# Altium schematic sheet Amplifier.SchDoc
size A4; SheetNumber: 2; SheetTotal: 2
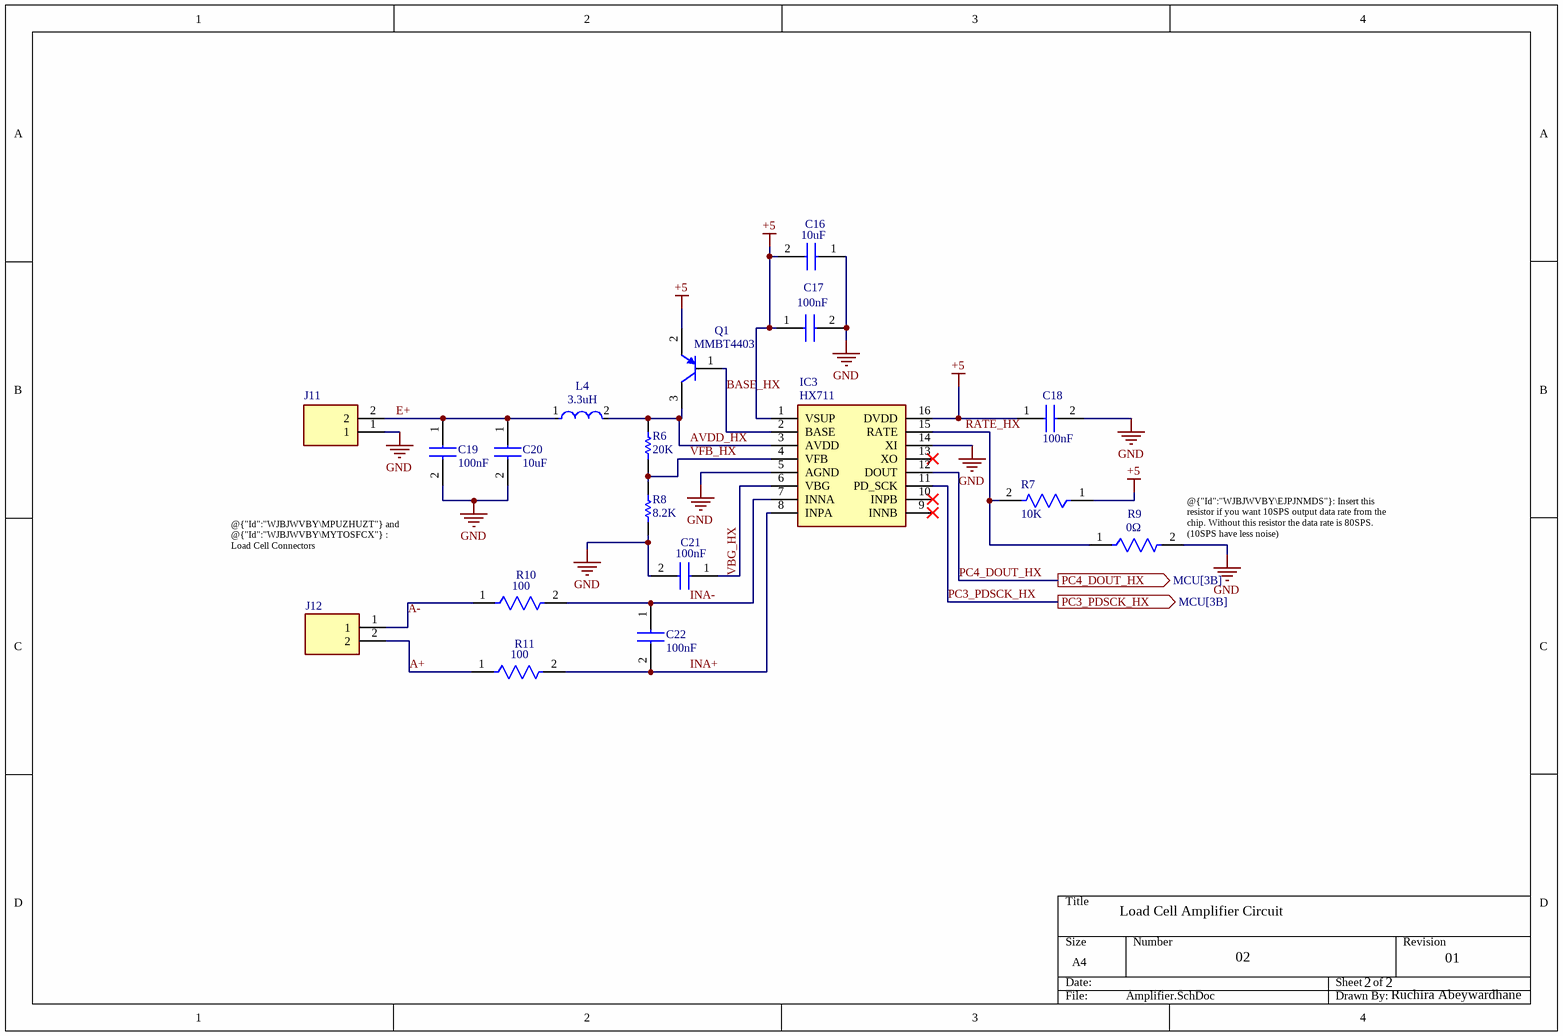
[diagram p0: Amplifier.SchDoc]

## Parts
C16  value 10uF  [C0805]  (hidden comment: C0805C106K4PAC7210)
C17  value 100nF  [C0805]  (hidden comment: C0805Y104J3RACTU)
C18  value 100nF  [C0805]  (hidden comment: C0805Y104J3RACTU)
C19  value 100nF  [C0805]  (hidden comment: C0805Y104J3RACTU)
C20  value 10uF  [C0805]  (hidden comment: C0805C106K4PAC7210)
C21  value 100nF  [C0805]  (hidden comment: C0805Y104J3RACTU)
C22  value 100nF  [C0805]  (hidden comment: C0805Y104J3RACTU)
IC3  HX711  [SOIC127P600X160-16N]
J11  1727010  [1727010]  (value not drawn)
J12  1727010  [1727010]  (value not drawn)
L4  value 3.3uH  [FP-MLZ2012-0_85-IPC_C]  (hidden comment: MLZ2012A3R3WTD25)
Q1  Model: MMBT4403  [ONSC-SOT-723-3-631AA-01_C_V]  (hidden comment: MMBT4403M3T5G)
R6  value 20K  [RESC2013X60X30LL20T20]  (hidden comment: RK73H2ATTD2002F)
R7  value 10K  [FP-RK73H2A-IPC_C]  (hidden comment: RK73H2ATTED1002F)
R8  value 8.2K  [RESC2013X60X30NL20T20]  (hidden comment: RK73H2ATTD8201F)
R9  Resistance: 0Ω  [FP-RCC0805-e3-MFG]  (hidden comment: RCC08050000Z0EA)
R10  value 100  [FP-RK73H2A-IPC_A]  (hidden comment: RK73H2ATTED1000F)
R11  value 100  [FP-RK73H2A-IPC_A]  (hidden comment: RK73H2ATTED1000F)

## Ports
PC3_PDSCK_HX (out, see MCU[3B]), PC4_DOUT_HX (out, see MCU[3B])

## Nets
+5: C16.2 C17.1 C18.1 IC3.1(VSUP) IC3.16(DVDD) Q1.2(E) R7.1
GND: C16.1 C17.2 C18.2 C19.2 C20.2 C21.2 IC3.5(AGND) IC3.14(XI) J11.1 R8.1 R9.2
A+: J12.2 R11.1
A-: J12.1 R10.1
AVDD_HX: IC3.3(AVDD) L4.2 Q1.3(C) R6.2
BASE_HX: IC3.2(BASE) Q1.1(B)
E+: C19.1 C20.1 J11.2 L4.1
INA+: C22.2 IC3.8(INPA) R11.2
INA-: C22.1 IC3.7(INNA) R10.2
PC3_PDSCK_HX: IC3.11(PD_SCK) ; port PC3_PDSCK_HX
PC4_DOUT_HX: IC3.12(DOUT) ; port PC4_DOUT_HX
RATE_HX: IC3.15(RATE) R7.2 R9.1
VBG_HX: C21.1 IC3.6(VBG)
VFB_HX: IC3.4(VFB) R6.1 R8.2

Not connected (* = marked no-connect by the designer): IC3 9(INNB)* 10(INPB)* 13(XO)*

## Notes on the sheet
- @{"Id":"WJBJWVBY\MPUZHUZT"} and @{"Id":"WJBJWVBY\MYTOSFCX"} : Load Cell Connectors
- (near R9) @{"Id":"WJBJWVBY\EJPJNMDS"}: Insert this resistor if you want 10SPS output data rate from the chip. Without this resistor the data rate is 80SPS. (10SPS have less noise)
- Load Cell Amplifier Circuit
- 02
- 2
- 01
- Ruchira Abeywardhane

## Library data of the parts
C16 C20 = C0805C106K4PAC7210: Capacitor; Manufacturer_Name: KEMET; Datasheet Link: https://content.kemet.com/datasheets/KEM_C1006_X5R_SMD.pdf; Height: 1.1mm; Manufacturer_Part_Number: C0805C106K4PAC7210; Mouser Part Number: 80-C0805C106K4P7210; Mouser Price/Stock: https://www.mouser.co.uk/ProductDetail/KEMET/C0805C106K4PAC7210?qs=zDkSFN9STR9jrJZBgSwCDA%3D%3D; Arrow Part Number: C0805C106K4PAC7210; Arrow Price/Stock: https://www.arrow.com/en/products/c0805c106k4pac7210/kemet-corporation
C17-C19 C21 C22 = C0805Y104J3RACTU: Capacitor; Manufacturer_Name: KEMET; Datasheet Link: https://content.kemet.com/datasheets/KEM_C1015_X7R_FF-CAP_SMD.pdf; Height: 1.1mm; Manufacturer_Part_Number: C0805Y104J3RACTU
IC3 = HX711: Integrated Circuit; Manufacturer_Name: AVIA; Datasheet Link: https://cdn.sparkfun.com/datasheets/Sensors/ForceFlex/hx711_english.pdf; Height: 1.6mm; Manufacturer_Part_Number: HX711
J11 J12 = 1727010: Connector; Manufacturer_Name: Phoenix Contact; Datasheet Link: https://datasheet.datasheetarchive.com/originals/distributors/SFDatasheet-2/sf-00050638.pdf; Height: 8.65mm; Manufacturer_Part_Number: 1727010; Mouser Part Number: 651-1727010; Mouser Price/Stock: https://www.mouser.co.uk/ProductDetail/Phoenix-Contact/1727010?qs=JcjeNNoqGSMjtHhQoBJ7UA%3D%3D; Arrow Part Number: 1727010; Arrow Price/Stock: https://www.arrow.com/en/products/1727010/phoenix-contact?region=nac
L4 = CMP-08253-000097-1: Shielded Multilayer Inductor 3.3uH ±20% 450mA 442mΩ AEC-Q200 SMD 0805; Saturation Current: 200mA; Core Material: Ferrite; Test Frequency: 10MHz; DC Resistance (DCR): 442mR; Resistance: 0.442R; Height: 0.85mm; Tolerance: 20%; RoHS Compliant: Yes; Min Operating Temperature: -55°C; Inductance: 3.3uH; Termination: SMD/SMT; Shielding: Shielded; Case Code (Metric): 2012; Max Operating Temperature: 125°C; Height - Seated (Max): 0.041inch; Ratings: AEC-Q200; Case/Package: 0805; Mount: Surface Mount; Length: 0.079inch; Packaging: Tape and Reel; Current Rating: 450mA; Package Quantity: 4000; Case Code (Imperial): 0805; Max DC Current: 450mA; Weight: 0.000194oz; Width: 0.049inch
Q1 = CMP-1048-00929-1: PNP Switching Transistor, 3-Pin SOT-723, Pb-Free, Tape and Reel; Manufacturer: On Semiconductor; IC Continuous (A): -0.6; fT Min (MHz): 200; ComponentLink1URL: http://www.onsemi.com/; PartNumber: MMBT4403M3T5G; ComponentLink3Description: Package Specification; PackageVersion: Rev. C, 08/2006; RoHS: TRUE; ComponentLink2Description: Datasheet; DatasheetVersion: Rev. 0; Mounting Technology: Surface Mount; Polarity: PNP; ComponentLink1Description: Manufacturer URL; PackageReference: SOT-723-3-631AA-01_C; Packing: Tape and Reel; PackageDescription: 3-Pin SOT223, Body 0.8 x 1.2 mm, Pitch 0.4 mm; ComponentLink3URL: http://www.onsemi.cn/pub_link/Collateral/BAT54M3-D.PDF; ComponentLink2URL: http://www.onsemi.com/pub_link/Collateral/MMBT4403M3-D.PDF
R6 = CMP-2001-02185-1: Manufacturer: KOA Speer; Part Number: RK73H2ATTD2002F
R7 = CMP-04015-088604-1: 10kΩ ±1% 0.25W Chip Resistor 0805 Thick Film AEC-Q200 Qualified; Resistance: 10kR; Voltage Rating: 150V; Temperature Coefficient: 100ppm/°C; Power Rating: 125mW; Packaging: Tape and Reel; Case Code (Imperial): 0805; Min Operating Temperature: -55°C; Height: 0.5mm; Construction: Rectangular; Tolerance: 1%; Termination: SMD/SMT; Case Code (Metric): 2012; Max Operating Temperature: 155°C; Package Quantity: 10000; RoHS Compliant: Yes; Lead Free: Lead Free; Series: RK73H; Depth: 1.25mm; Case/Package: 0805; Length: 2mm; Width: 1.25mm; Resistor Type: Thick Film; Military Standard: Not
R8 = CMP-2001-02517-1: Manufacturer: KOA Speer; Part Number: RK73H2ATTD8201F
R9 = CMP-00030-108211984-1: RCC08050000Z0EA Res Thick Film 0805 0 Ohm Conformal Coated Pad SMD Automotive AEC-Q200 T/R; Voltage Rating: 200V; Power Rating: 250mW; Composition: Thick Film; Max Operating Temperature: 155°C; Case/Package: 0805; Height: 500µm; NexarPartId: 108211984; Min Operating Temperature: -55°C
R10 R11 = CMP-04015-093159-1: 100Ω ±1% 0.25W Chip Resistor 0805 Thick Film AEC-Q200 Qualified; Voltage Rating: 150V; Temperature Coefficient: 100ppm/°C; Power Rating: 125mW; Resistance: 100R; Series: RK73H; Resistor Type: Thick Film; Military Standard: Not; Construction: Rectangular; Termination: SMD/SMT; Tolerance: 1%; Max Operating Temperature: 155°C; Packaging: Tape and Reel; Min Operating Temperature: -55°C; Length: 2mm; Case/Package: 0805; Case Code (Imperial): 0805; Case Code (Metric): 2012; Depth: 1.25mm; Lead Free: Lead Free